# Altium schematic sheet 独立按键.SchDoc
size A4
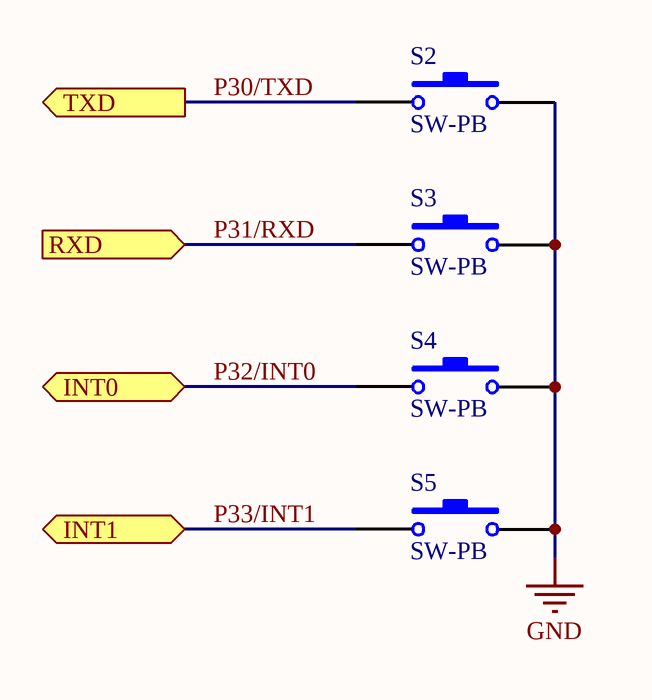
[diagram p0: 独立按键.SchDoc]

## Parts
S2  SW-PB  [SPST-2]
S3  SW-PB  [SPST-2]
S4  SW-PB  [SPST-2]
S5  SW-PB  [SPST-2]

## Ports
INT0 (bidir), INT1 (bidir), RXD (in), TXD (out)

## Nets
GND: S2.2 S3.2 S4.2 S5.2
P30/TXD: S2.1 ; port TXD
P31/RXD: S3.1 ; port RXD
P32/INT0: S4.1 ; port INT0
P33/INT1: S5.1 ; port INT1

## Notes on the sheet
- 专升本
- 通信工程
- 李烨攀
- 2101班
- 210806300163
- 学号

## Library data of the parts
S2-S5 = SW-PB: Switch; Published: 24-Mar-1999; LatestRevisionDate: 17-Jul-2002; LatestRevisionNote: Re-released for DXP Platform.; PackageReference: SPST-2; Publisher: Altium Limited; PackageDescription: Switch; 2 Leads